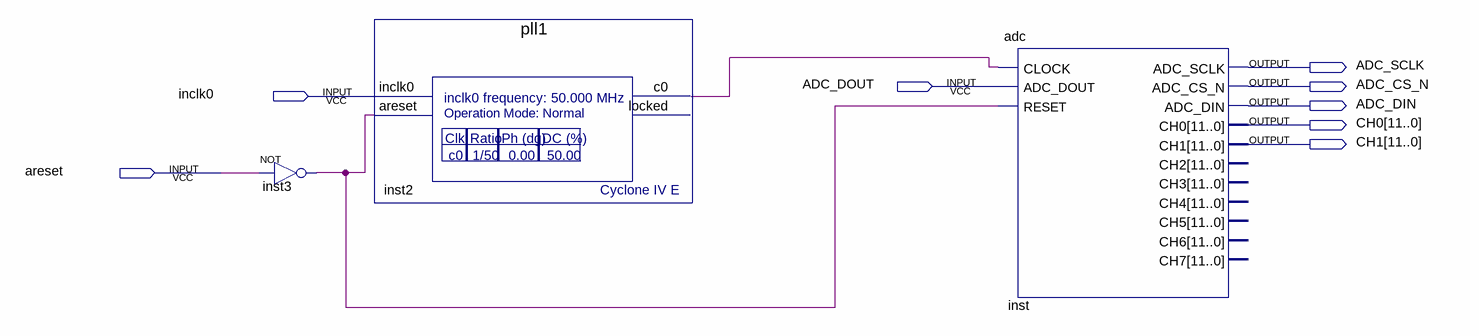
[diagram p0: schematic sheet]
// Quartus schematic esqumaticoADC.bdf as structural Verilog: 3 symbols, 8 pins
module esqumaticoADC (
  input  ADC_DOUT,
  input  inclk0,
  input  areset,
  output ADC_SCLK,
  output ADC_CS_N,
  output ADC_DIN,
  output [11:0] CH0,
  output [11:0] CH1
);

  wire inst2_c0, inst3_out;

  not inst3 (inst3_out, areset);
  pll1 inst2 (.inclk0(inclk0), .areset(inst3_out), .c0(inst2_c0));  // open: locked
  adc inst (
    .CLOCK(inst2_c0), .ADC_DOUT(ADC_DOUT), .RESET(inst3_out), .ADC_SCLK(ADC_SCLK), .ADC_CS_N(ADC_CS_N),
    .ADC_DIN(ADC_DIN), .CH0(CH0), .CH1(CH1));  // open: CH2, CH3, CH4, CH5, CH6, CH7
endmodule
